# Altium schematic sheet Actuator Control.SchDoc
size A; SheetNumber: 3; SheetTotal: 3
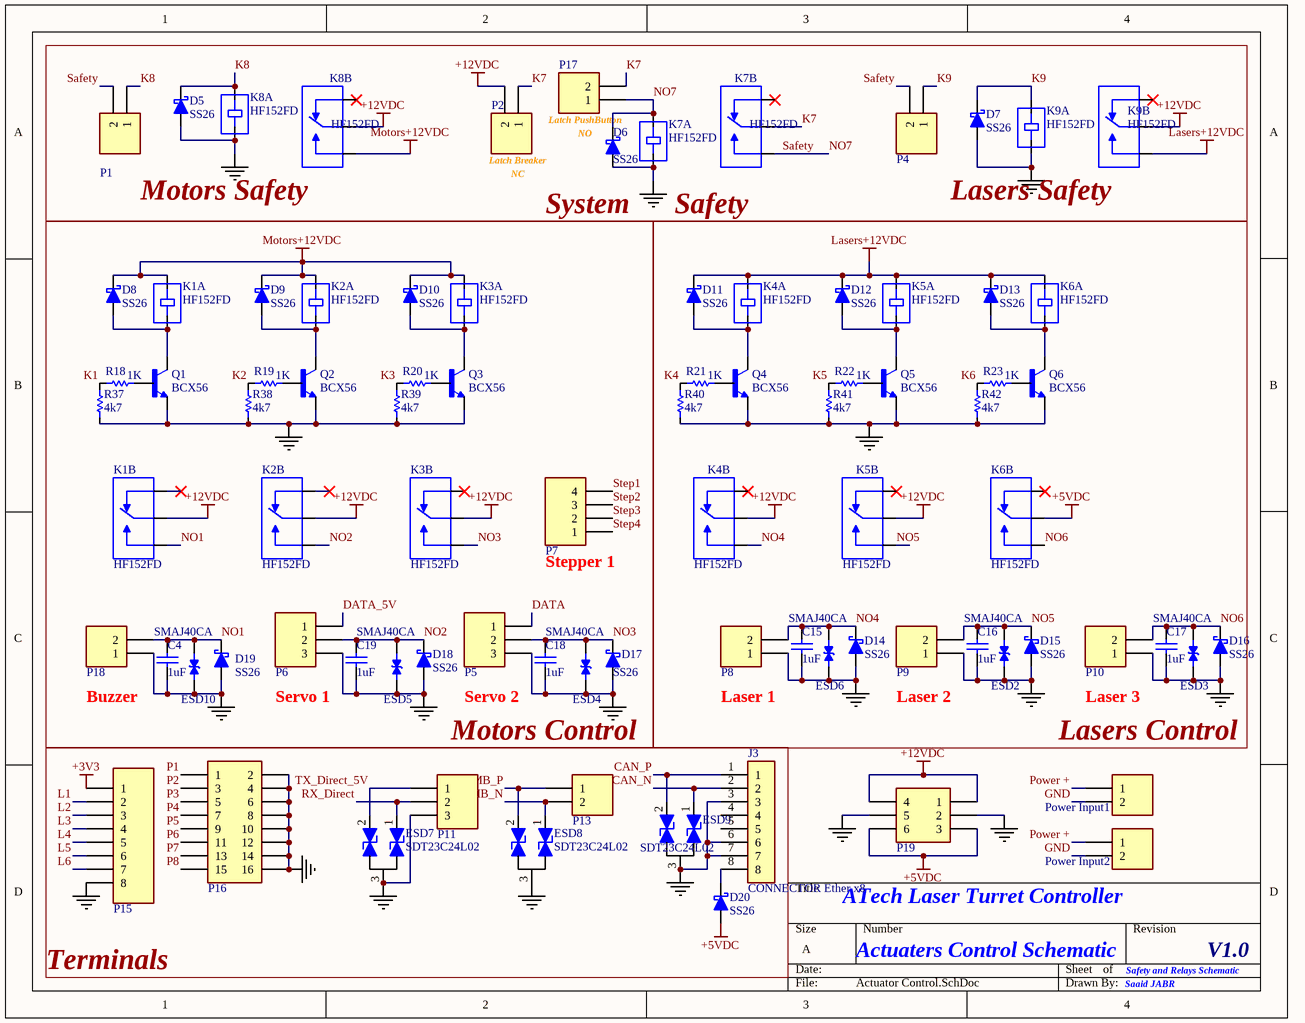
[diagram p0: Actuator Control.SchDoc]

## Parts
C4  1uF  [CC3216-1206L]
C15  1uF  [CC3216-1206L]
C16  1uF  [CC3216-1206L]
C17  1uF  [CC3216-1206L]
C18  1uF  [CC3216-1206L]
C19  1uF  [CC3216-1206L]
D5  SS26  [SMB]
D6  SS26  [SMB]
D7  SS26  [SMB]
D8  SS26  [SMB]
D9  SS26  [SMB]
D10  SS26  [SMB]
D11  SS26  [SMB]
D12  SS26  [SMB]
D13  SS26  [SMB]
D14  SS26  [SMB]
D15  SS26  [SMB]
D16  SS26  [SMB]
D17  SS26  [SMB]
D18  SS26  [SMB]
D19  SS26  [SMB]
D20  SS26  [SMB]
ESD2  SMAJ40CA  [DIOM4325X250N]
ESD3  SMAJ40CA  [DIOM4325X250N]
ESD4  SMAJ40CA  [DIOM4325X250N]
ESD5  SMAJ40CA  [DIOM4325X250N]
ESD6  SMAJ40CA  [DIOM4325X250N]
ESD7  SDT23C24L02  [SOT23-3]
ESD8  SDT23C24L02  [SOT23-3]
ESD9  SDT23C24L02  [SOT23-3]
ESD10  SMAJ40CA  [DIOM4325X250N]
J3  CONNECTOR Ether x8  [EtherNet 8P]
K1  HF152FD  [RELAY_HF152FD/012-1HS]  (parts A,B of 2)
K2  HF152FD  [RELAY_HF152FD/012-1HS]  (parts A,B of 2)
K3  HF152FD  [RELAY_HF152FD/012-1HS]  (parts A,B of 2)
K4  HF152FD  [RELAY_HF152FD/012-1HS]  (parts A,B of 2)
K5  HF152FD  [RELAY_HF152FD/012-1HS]  (parts A,B of 2)
K6  HF152FD  [RELAY_HF152FD/012-1HS]  (parts A,B of 2)
K7  HF152FD  [RELAY_HF152FD/012-1HS]  (parts A,B of 2)
K8  HF152FD  [RELAY_HF152FD/012-1HS]  (parts A,B of 2)
K9  HF152FD  [RELAY_HF152FD/012-1HS]  (parts A,B of 2)
P1  CONNECTOR, 1x2, 2P  [DG128-5.0-02P-14]  (value not drawn)
P2  CONNECTOR, 1x2, 2P  [DG128-5.0-02P-14]  (value not drawn)
P4  CONNECTOR, 1x2, 2P  [DG128-5.0-02P-14]  (value not drawn)
P5  CONNECTOR, 1x3, 3P  [HDR_MALE_1X3_2.50mm_JST]  (value not drawn)
P6  CONNECTOR, 1x3, 3P  [HDR_MALE_1X3_2.50mm_JST]  (value not drawn)
P7  CONNECTOR, 1x4, 4P  [HDR_MALE_1X4_2.50mm_JST]  (value not drawn)
P8  CONNECTOR, 1x2, 2P  [HDR_MALE_1X2_2.50mm_JST]  (value not drawn)
P9  CONNECTOR, 1x2, 2P  [HDR_MALE_1X2_2.50mm_JST]  (value not drawn)
P10  CONNECTOR, 1x2, 2P  [HDR_MALE_1X2_2.50mm_JST]  (value not drawn)
P11  CONNECTOR, 1x3, 3P  [HDR_MALE_1X3_3P_2.54MM_180]  (value not drawn)
P13  CONNECTOR, 1x2, 2P  [DG128-5.0-02P-14]  (value not drawn)
P15  CONNECTOR 1X8-8P  [HDR_MALE_1X8_8P_2.54MM_180]  (value not drawn)
P16  CONNECTOR 2X8-16P  [HDR_MALE_2X8_16P_2.54MM_180]  (value not drawn)
P17  CONNECTOR, 1x2, 2P  [DG128-5.0-02P-14]  (value not drawn)
P18  CONNECTOR, 1x2, 2P  [HDR_MALE_1X2_2.50mm_JST]  (value not drawn)
P19  CONNECTOR, 1x3, 3P  [HDR_MALE_2X3_6P_2.54MM_180]  (value not drawn)
Power_Input1  CONNECTOR, 1x2, 2P  [DG128-5.0-02P-14]  (value not drawn)
Power_Input2  CONNECTOR, 1x2, 2P  [2EDGVM-5.0-02P-14]  (value not drawn)
Q1  BCX56  [SOT89R_INFINEON]
Q2  BCX56  [SOT89R_INFINEON]
Q3  BCX56  [SOT89R_INFINEON]
Q4  BCX56  [SOT89R_INFINEON]
Q5  BCX56  [SOT89R_INFINEON]
Q6  BCX56  [SOT89R_INFINEON]
R18  1K  [CR3216-1206l]
R19  1K  [CR3216-1206l]
R20  1K  [CR3216-1206l]
R21  1K  [CR3216-1206l]
R22  1K  [CR3216-1206l]
R23  1K  [CR3216-1206l]
R37  4k7  [CR3216-1206l]
R38  4k7  [CR3216-1206l]
R39  4k7  [CR3216-1206l]
R40  4k7  [CR3216-1206l]
R41  4k7  [CR3216-1206l]
R42  4k7  [CR3216-1206l]

## Nets
+3V3: P15.1
+5VDC: D20.1 K6.3(COM) P19.3 P19.6
+12VDC: K1.3(COM) K2.3(COM) K3.3(COM) K4.3(COM) K5.3(COM) K8.3(COM) K9.3(COM) P2.2 P19.1 P19.4
GND: C4.2 C15.2 C16.2 C17.2 C18.2 C19.2 D5.1 D6.1 D7.1 D14.1 D15.1 D16.1 D17.1 D18.1 D19.1 ESD2.1 ESD3.1 ESD4.1 ESD5.1 ESD6.1 ESD7.3 ESD8.3 ESD9.3 ESD10.1 J3.3 J3.6 J3.7 K7.1(COIL2) K8.1(COIL2) K9.1(COIL2) P5.3 P6.3 P8.1 P9.1 P10.1 P11.3 P15.8 P16.2 P16.4 P16.6 P16.8 P16.10 P16.12 P16.14 P16.16 P18.1 P19.2 P19.5 Power_Input1.2 Power_Input2.2 Q1.3(E) Q2.3(E) Q3.3(E) Q4.3(E) Q5.3(E) Q6.3(E) R37.1 R38.1 R39.1 R40.1 R41.1 R42.1
Lasers+12VDC: D11.2 D12.2 D13.2 K4.2(COIL1) K5.2(COIL1) K6.2(COIL1) K9.4(NO)
Motors+12VDC: D8.2 D9.2 D10.2 K1.2(COIL1) K2.2(COIL1) K3.2(COIL1) K8.4(NO)
CAN_N: ESD9.1 J3.2
CAN_P: ESD9.2 J3.1
DATA: P5.1
DATA_5V: P6.1
K1: R18.2 R37.2
K2: R19.2 R38.2
K3: R20.2 R39.2
K4: R21.2 R40.2
K5: R22.2 R41.2
K6: R23.2 R42.2
K7: K7.3(COM) P2.1 P17.2
K8: D5.2 K8.2(COIL1) P1.1
K9: D7.2 K9.2(COIL1) P4.1
L1: P15.2
L2: P15.3
L3: P15.4
L4: P15.5
L5: P15.6
L6: P15.7
MB_N: ESD8.1 P13.2
MB_P: ESD8.2 P13.1
NO1: C4.1 D19.2 ESD10.2 K1.4(NO) P18.2
NO2: C19.1 D18.2 ESD5.2 K2.4(NO) P6.2
NO3: C18.1 D17.2 ESD4.2 K3.4(NO) P5.2
NO4: C15.1 D14.2 ESD6.2 K4.4(NO) P8.2
NO5: C16.1 D15.2 ESD2.2 K5.4(NO) P9.2
NO6: C17.1 D16.2 ESD3.2 K6.4(NO) P10.2
NO7: D6.2 K7.2(COIL1) K7.4(NO) P1.2 P4.2 P17.1  [also labelled Safety]
P1: P16.1
P2: P16.3
P3: P16.5
P4: P16.7
P5: P16.9
P6: P16.11
P7: P16.13
P8: P16.15
Power +: Power_Input1.1 Power_Input2.1
RX_Direct: ESD7.1 P11.2
Step1: P7.4
Step2: P7.3
Step3: P7.2
Step4: P7.1
TX_Direct_5V: ESD7.2 P11.1
NetD8_1: D8.1 K1.1(COIL2) Q1.2(C)
NetD9_1: D9.1 K2.1(COIL2) Q2.2(C)
NetD10_1: D10.1 K3.1(COIL2) Q3.2(C)
NetD11_1: D11.1 K4.1(COIL2) Q4.2(C)
NetD12_1: D12.1 K5.1(COIL2) Q5.2(C)
NetD13_1: D13.1 K6.1(COIL2) Q6.2(C)
NetD20_2: D20.2 J3.8
NetQ1_1: Q1.1(B) R18.1
NetQ2_1: Q2.1(B) R19.1
NetQ3_1: Q3.1(B) R20.1
NetQ4_1: Q4.1(B) R21.1
NetQ5_1: Q5.1(B) R22.1
NetQ6_1: Q6.1(B) R23.1

Not connected (* = marked no-connect by the designer): J3 4 5; K1 5(NC)*; K2 5(NC)*; K3 5(NC)*; K4 5(NC)*; K5 5(NC)*; K6 5(NC)*; K7 5(NC)*; K8 5(NC)*; K9 5(NC)*

## Notes on the sheet
- Latch Breaker
- Latch PushButton
- NO
- (near K8) Motors Safety
- NC
- System      Safety
- (near K9) Lasers Safety
- (near P7) Stepper 1
- Buzzer
- Servo 1
- Servo 2
- Laser 1
- Laser 2
- Laser 3
- Motors Control
- Lasers Control
- (near Power_Input2) ATech Laser Turret Controller
- Terminals
- Actuaters Control Schematic
- Safety and Relays Schematic
- V1.0
- Saaid JABR

## Library data of the parts
C4 C15-C19 = CAPACITOR NON-POL: Capacitor; Ozdisan: CL31B104KCFNNNE; Stock Code: *; Component Type: Capacitor; PriceUSD: 0.001135
D5-D20 = DIODE SCHOTTKY: SINGLE SCHOTTKY DIODE / Check the suitability of the case with the pin number; Ozdisan: SS26-SMB-JQ; Stock Code: *; Component Type: Diode; PriceUSD: 0.006698
ESD2-ESD6 ESD10 = SMAJ40CA: Ozdisan: SMAJ40CA-HT; Price: None; Availability: Unavailable; Package: None; MP: SMAJ40CA; Value: *; PriceUSD: 0.012908
J3 = CONNECTOR Ether x8: Jack Modular Connector 8p8c (RJ45, Ethernet) 90Â° Angle (Right) Shielded, EMI Finger Cat3; MP: 0438600004; MF: Molex; SnapEDA_Link: https://www.snapeda.com/parts/0438600004/Molex/view-part/?ref=snap; Package: None; Check_prices: https://www.snapeda.com/parts/0438600004/Molex/view-part/?ref=eda; Purchase-URL: https://pricing.snapeda.com/search/part/0438600004/?ref=eda; Digi-Key_Part_Number: WM5438-ND; Value: *
K1-K9 = Relay-HF152FD/012
P1 P2 P4 P8-P10 P13 P17 P18 Power_Input1 Power_Input2 = CONNECTOR, 1x2, 2P: Ozdisan: DG128-5.0-02P-14-00AH; Stock Code: *; Component Type: Connector; PriceUSD: 0.10443
P15 = CONNECTOR, 1X8, 8P: Stock Code: *; Component Type: Connector
P16 = CONNECTOR, 2x8, 16P: Stock Code: *; Component Type: Connector
P19 = CONNECTOR, 2x3, 3P: Component Type: Connector
Q1-Q6 = BCX56: BCX56-16,115 Bipolar (BJT) Transistor NPN 80 V 1 A 180MHz 1.25 W Surface Mount SOT-89; MF: Nexperia USA; SnapEDA_Link: https://www.snapeda.com/parts/BCX56-16,115/Nexperia/view-part/?ref=snap; Package: SOT89-3 Nexperia USA Inc.; Value: *; MP: BCX56-16,115; Check_prices: https://www.snapeda.com/parts/BCX56-16,115/Nexperia/view-part/?ref=eda
R18-R23 R37-R42 = RESISTOR: Ozdisan: RC1206JR-074K7L; Component Type: Resistor; PriceUSD: 0.0000351
ESD7-ESD9 = SDT23C24L02: Stock Code: *; Component Type: Diode; Ozdisan: SDT23C24L02; PriceUSD: 0.09211
P5 P6 P11 = CONNECTOR, 1x3, 3P: Component Type: Connector
P7 = CONNECTOR, 1x4, 4P: Component Type: Connector